# EAGLE design Volumetric Control Board (EAGLE 9.6.1)
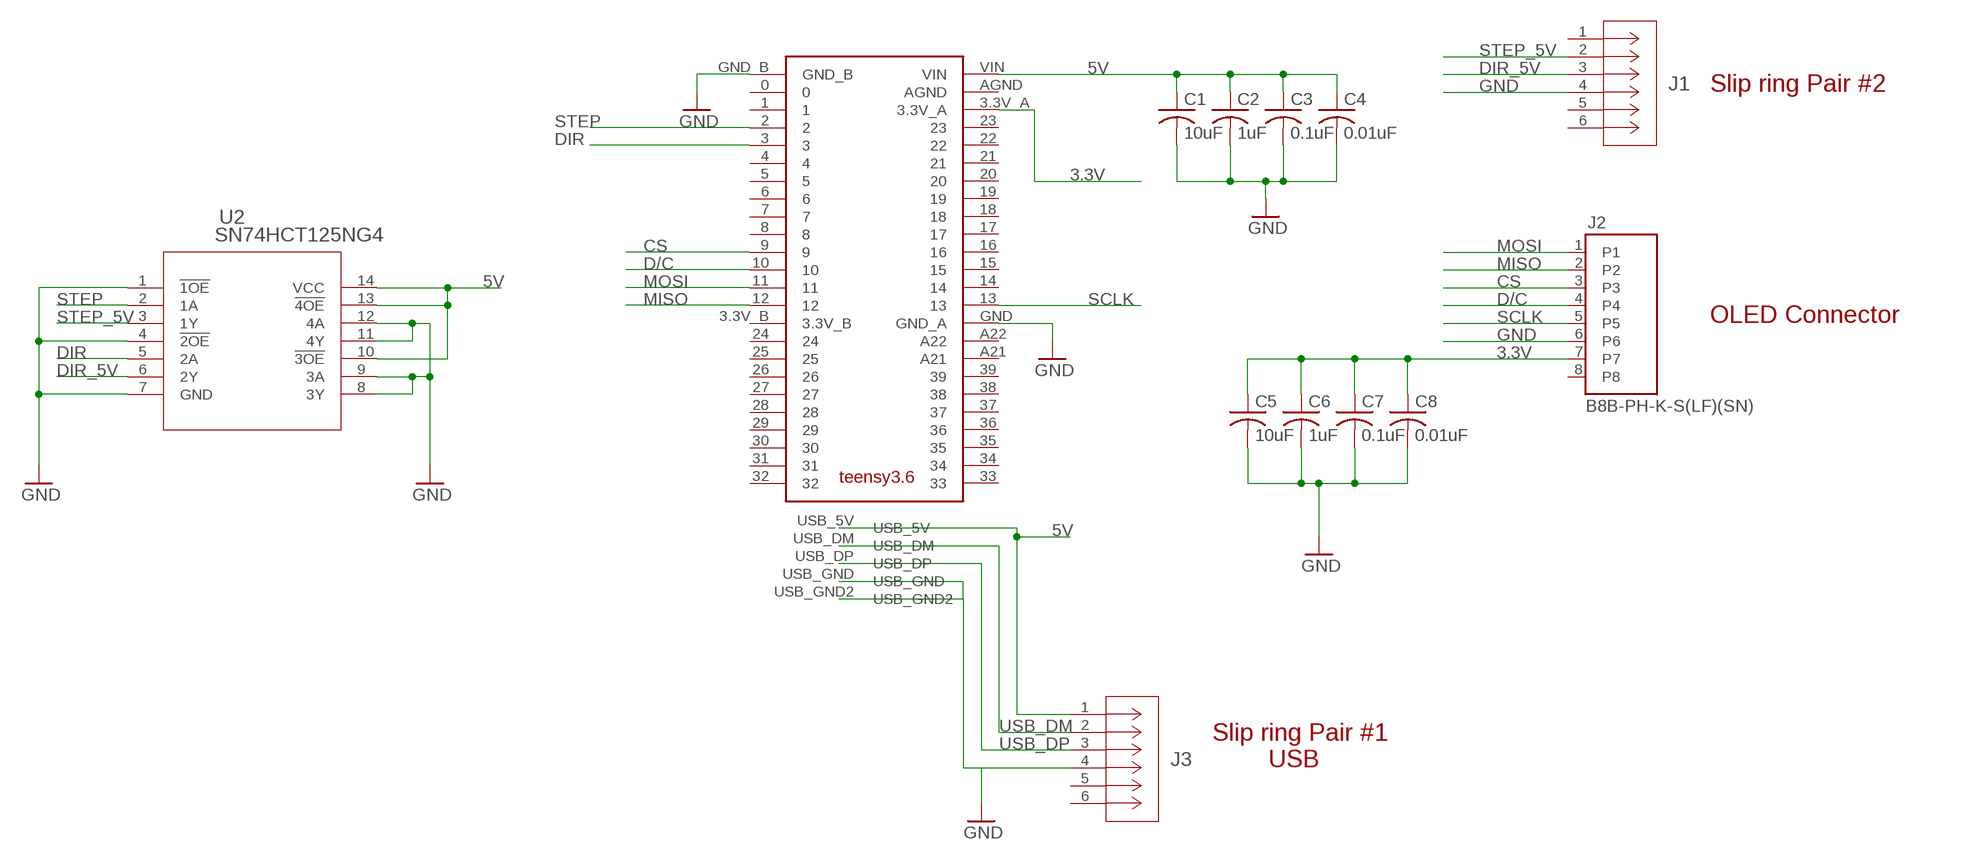
[diagram p0: schematic, sheet 1]

## Parts
C1  10uF  C-USC1206  [C1206]
C2  1uF  C-USC1206  [C1206]
C3  0.1uF  C-USC1206  [C1206]
C4  0.01uF  C-USC1206  [C1206]
C5  10uF  C-USC1206  [C1206]
C6  1uF  C-USC1206  [C1206]
C7  0.1uF  C-USC1206  [C1206]
C8  0.01uF  C-USC1206  [C1206]
J1  B6B-PH-K-S(LF)(SN)  [CONN_B6B-PH-K-S_JST]
J2  B8B-PH-K-S(LF)(SN)  [JST_B8B-PH-K-S(LF)(SN)]
J3  B6B-PH-K-S(LF)(SN)  [CONN_B6B-PH-K-S_JST]
U2  SN74HCT125NG4  [N14_TEX]
U$1  TEENSY3.6  [TEENSY3.6]

## Nets
3.3V: C5.1 C6.1 C7.1 C8.1 J2.7 U$1.3.3V_A
5V: C1.1 C2.1 C3.1 C4.1 J3.1 U2.10(!3OE) U2.13(!4OE) U2.14(VCC) U$1.USB_5V U$1.VIN
CS: J2.3 U$1.9
D/C: J2.4 U$1.10
DIR: U2.5(2A) U$1.3
DIR_5V: J1.3 U2.6(2Y)
GND: C1.2 C2.2 C3.2 C4.2 C5.2 C6.2 C7.2 C8.2 J1.4 J2.6 J3.4 U2.1(!1OE) U2.4(!2OE) U2.7(GND) U2.8(3Y) U2.9(3A) U2.11(4Y) U2.12(4A) U$1.GND(GND_A) U$1.GND_B U$1.USB_GND U$1.USB_GND2
MISO: J2.2 U$1.12
MOSI: J2.1 U$1.11
SCLK: J2.5 U$1.13
STEP: U2.2(1A) U$1.2
STEP_5V: J1.2 U2.3(1Y)
USB_DM: J3.2 U$1.USB_DM
USB_DP: J3.3 U$1.USB_DP
Unconnected: J1.1 J1.5 J1.6 J2.8 J3.5 J3.6 U$1.0 U$1.1 U$1.3.3V_B U$1.4 U$1.5 U$1.6 U$1.7 U$1.8 U$1.14 U$1.15 U$1.16 U$1.17 U$1.18 U$1.19 U$1.20 U$1.21 U$1.22 U$1.23 U$1.24 U$1.25 U$1.26 U$1.27 U$1.28 U$1.29 U$1.30 U$1.31 U$1.32 U$1.33 U$1.34 U$1.35 U$1.36 U$1.37 U$1.38 U$1.39 U$1.A21 U$1.A22 U$1.AGND

## Notes on the sheet
- Slip ring Pair #2
- OLED Connector
- Slip ring Pair #1
          USB

## Library data of the parts
C1-C8 = rcl:C-US: CAPACITOR, American symbol; SPICEPREFIX: C
J1 J3 = volumetric_display:B6B-PH-K-S(LF)(SN); COPYRIGHT: Copyright (C) 2021 Ultra Librarian. All rights reserved.; DIGI-KEY_PART_NUMBER_1: 455-1708-ND; MANUFACTURER_PART_NUMBER: B6B-PH-K-S(LF)(SN); MFR_NAME: JST
J2 = volumetric_display:B8B-PH-K-S(LF)(SN): PH Series 2 mm Pitch 8 Position Through Hole Top Entry Shrouded Header; DESCRIPTION: Connector Header Through Hole 8 position 0.079 (2.00mm); DIGI-KEY_PART_NUMBER: 455-1710-ND; MF: JST Sales; MP: B8B-PH-K-S(LF)(SN); PACKAGE: None
U2 = volumetric_display:SN74HCT125NG4; COPYRIGHT: Copyright (C) 2021 Ultra Librarian. All rights reserved.; DIGI-KEY_PART_NUMBER_1: SN74HCT125NG4-ND; MANUFACTURER_PART_NUMBER: SN74HCT125NG4; MFR_NAME: Texas Instruments
U$1 = volumetric_display:TEENSY3.6

## Board
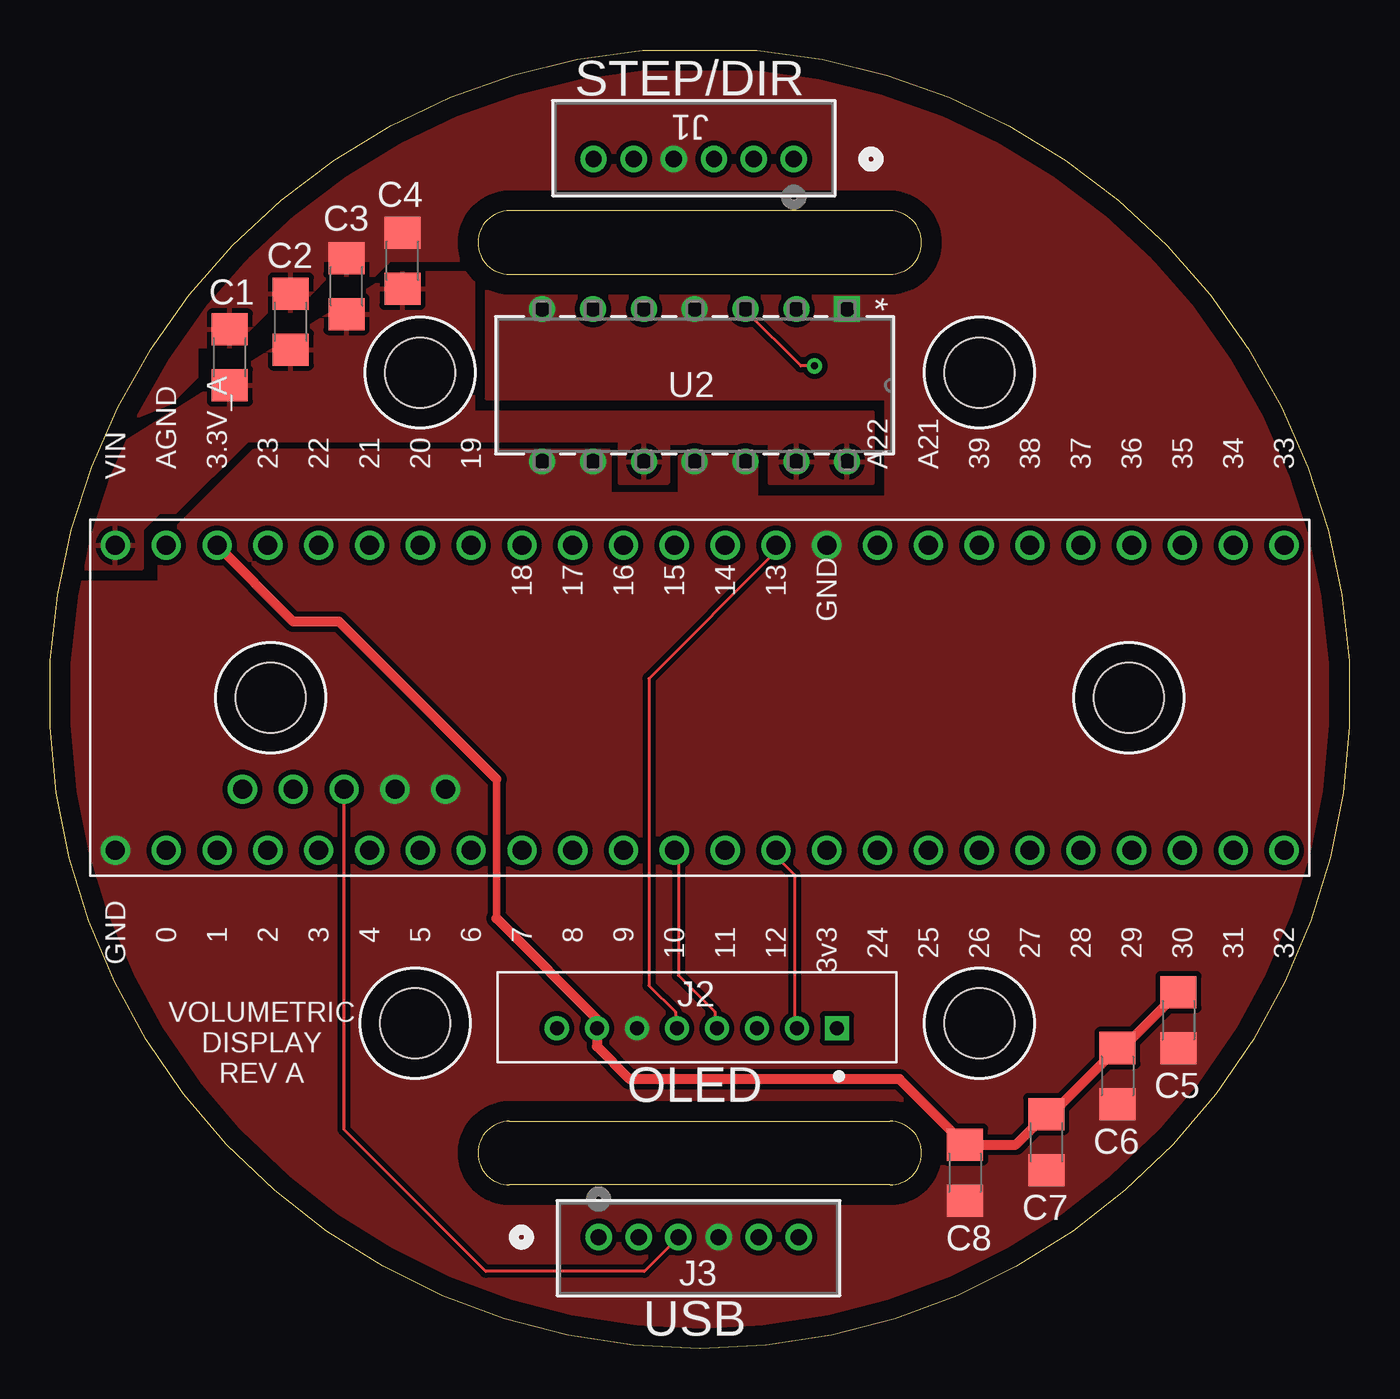
[diagram p1: board, top side]
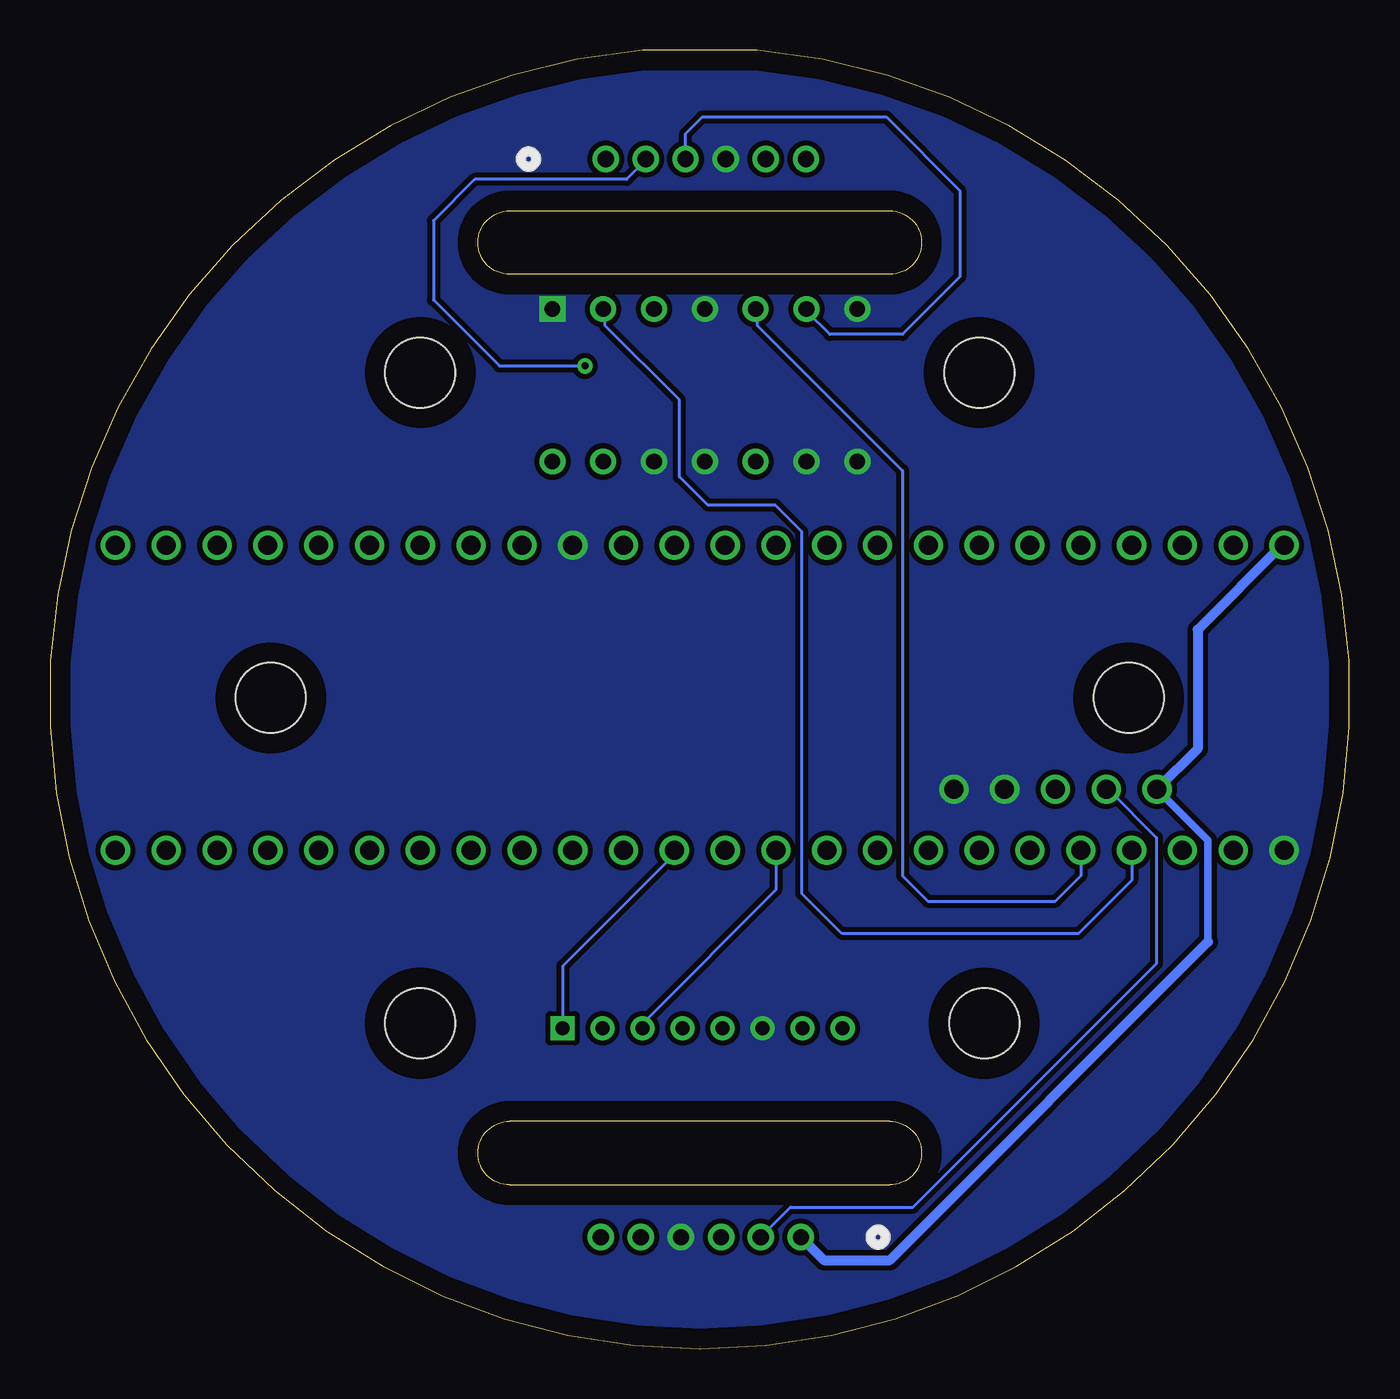
[diagram p2: board, bottom side, seen from below]

Size 64.96 x 64.9 mm. Coordinates in mm from the lower left corner, seen from the top.
Outline: 29.61,64.9 35.35,64.9 arc-350 29.61,64.9
Outline: 22.98,56.86 arc180 22.98,53.69 41.98,53.69 arc180 41.98,56.86 22.98,56.86
Outline: 41.98,8.19 22.98,8.19 arc-180 22.98,11.36 41.98,11.36 arc-180 41.98,8.19
Copper layers (1*16): Top 0.035mm / dielectric 1.5mm / Bottom 0.035mm
Design rules "default": minimum track width 6mil, minimum drill 0.35mm, track to track 6mil, track to pad 6mil, pad to pad 6mil, via to via 6mil, smd to smd 6mil, copper to edge 40mil, drill to drill 6mil, minimum pad ring 10mil, minimum via ring 8mil, stop-mask expansion 4mil, vias tented up to drill 0mil, thermal gap 10mil
Holes 3.5 mm at 53.92,32.52 11.04,32.52 18.51,48.78 46.45,16.27 46.45,48.78 18.26,16.27

### Footprints (pad centres in the part's own frame; a part is rotated, then mirrored left to right if it is on the bottom)
C1206 = smd 1.6 x 1.8: 1 -1.4,0; 2 1.4,0
CONN_B6B-PH-K-S_JST = drill 0.813 pad 1.321: 1 0,0; 2 2.007,0; 3 3.988,0; 4 5.994,0; 5 8.001,0; 6 10.008,0
JST_B8B-PH-K-S(LF)(SN) = drill 0.7 square: 1 0,0 | drill 0.7: 2 2,0; 3 4,0; 4 6,0; 5 8,0; 6 10,0; 7 12,0; 8 14,0
N14_TEX = drill 0.787 pad 1.295 square: 1 0,0 | drill 0.787 pad 1.295: 2 0,-2.54; 3 0,-5.08; 4 0,-7.62; 5 0,-10.16; 6 0,-12.7; 7 0,-15.24; 8 7.62,-15.24; 9 7.62,-12.7; 10 7.62,-10.16; 11 7.62,-7.62; 12 7.62,-5.08; 13 7.62,-2.54; 14 7.62,0
TEENSY3.6 = drill 0.95: 0 -15.24,-2.54; 1 -15.24,-5.08; 2 -15.24,-7.62; 3 -15.24,-10.16; 3.3V_A 0,-5.08; 3.3V_B -15.24,-35.56; 4 -15.24,-12.7; 5 -15.24,-15.24; 6 -15.24,-17.78; 7 -15.24,-20.32; 8 -15.24,-22.86; 9 -15.24,-25.4; 10 -15.24,-27.94; 11 -15.24,-30.48; 12 -15.24,-33.02; 13 0,-33.02; 14 0,-30.48; 15 0,-27.94; 16 0,-25.4; 17 0,-22.86; 18 0,-20.32; 19 0,-17.78; 20 0,-15.24; 21 0,-12.7; 22 0,-10.16; 23 0,-7.62; 24 -15.24,-38.1; 25 -15.24,-40.64; 26 -15.24,-43.18; 27 -15.24,-45.72; 28 -15.24,-48.26; 29 -15.24,-50.8; 30 -15.24,-53.34; 31 -15.24,-55.88; 32 -15.24,-58.42; 33 0,-58.42; 34 0,-55.88; 35 0,-53.34; 36 0,-50.8; 37 0,-48.26; 38 0,-45.72; 39 0,-43.18; A21 0,-40.64; A22 0,-38.1; AGND 0,-2.54; GND 0,-35.56; GND_B -15.24,0; USB_5V -12.19,-6.35; USB_DM -12.19,-8.89; USB_DP -12.19,-11.43; USB_GND -12.19,-13.97; USB_GND2 -12.19,-16.51; VIN 0,0

### Placement (x,y rotation side)
C1  8.99,49.54 90 top
C2  12.03,51.32 90 top
C3  14.83,53.1 90 top
C4  17.62,54.37 90 top
C5  56.41,16.42 270 top
C6  53.36,13.63 270 top
C7  49.8,10.32 270 top
C8  45.74,8.8 270 top
J1  37.18,59.45 180 top
J2  39.34,16.01 180 top
J3  27.43,5.57 0 top
U2  39.85,51.95 270 top
U$1  3.27,40.14 90 top

### Tracks (layer width: path | path; a pad name or v marks a point on that pad's centre or on a via)
3.3V
  Top 0.152: J2.7 27.57,16.25
  Top 0.381: 22.32,28.46 22.32,21.5
  Top 0.508: 22.32,21.5 27.57,16.25 | 22.32,28.46 14.45,36.33 12.16,36.33 U$1.3.3V_A | J2.7 27.34,15.11 28.98,13.47 42.47,13.47 C8.1 48.28,10.2 C7.1 50.06,11.72 C6.1 53.61,15.03 C5.1
5V
  Top 0.152: U2.10 29.69,44.54
  Bottom 0.152: 3.37,40.14 U$1.VIN
  Bottom 0.381: U$1.USB_5V 7.08,25.41 7.08,20.33
  Bottom 0.508: J3.1 26.28,4.43 22.98,4.43 7.08,20.33 | U$1.USB_5V 7.59,29.99 7.59,35.93 3.37,40.14
  pour Top (isolate 0.254): 41.09,46.77 41.09,43.27 36.01,43.27 36.01,45.25 35.99,45.27 30.88,45.27 30.88,43.32 30.83,43.27 28.52,43.27 28.52,45.4 9.82,45.4 6.24,41.82 5.43,41.82 4.57,40.96 4.57,39 -6.27,39 17.24,53.73 21.13,53.73 21.13,46.77
CS
  Bottom 0.152: U$1.9 28.67,22.92 35.22,16.37 35.22,16.06 J2.3
D/C
  Top 0.152: J2.4 33.24,16.06 33.24,16.83 31.41,18.66 31.41,24.75 31.26,24.9 U$1.10
DIR
  Bottom 0.152: U$1.3 13.43,23.63 14.7,22.36 21.08,22.36 22.35,23.63 22.35,43.88 29.58,51.12 29.58,51.88 U2.5
DIR_5V
  Bottom 0.152: U2.6 27.15,51.85 25.98,50.68 22.35,50.68 19.48,53.55 19.48,57.87 23.16,61.56 32.35,61.56 33.19,60.72 J1.3
GND
  pour Bottom (isolate 0.254, no thermals): -10.7,70.62 -10.7,-4.31 76.93,-4.31 76.93,70.62
  pour Top (isolate 0.254, no thermals): -1.81,54.44 21.08,54.44 21.84,53.68 21.84,47.51 41.8,47.51 41.8,42.51 35.3,42.51 35.3,44.56 31.49,44.56 31.49,42.68 27.96,42.68 27.96,44.84 10.2,44.84 5.48,40.12 5.48,38.24 -1.81,38.24 -1.81,-5.58 73.12,-5.58 73.12,70.62 -1.81,70.62
  pour Top: -3.08,55.38 17.24,55.38 17.24,54.62 16.22,53.61 13.94,53.61 12.92,52.59 12.92,51.83 10.89,51.83 9.87,50.81 9.87,50.05 7.33,50.05 7.33,48.53 6.06,47.26 4.33,46.54 3.78,45.99 3.52,45.99 2.76,45.22 -3.08,45.22
MISO
  Top 0.152: U$1.12 36.29,24.6 37.2,23.68 37.2,16.06 J2.2
MOSI
  Bottom 0.152: J2.1 39.34,19.11 33.85,24.6 33.85,24.9 U$1.11
SCLK
  Top 0.152: U$1.13 36.29,39.84 29.94,33.49 29.94,18.15 31.26,16.83 31.26,16.06 J2.5
STEP
  Bottom 0.152: U$1.2 10.89,23.4 13.56,20.74 25.37,20.74 27.38,22.74 27.38,40.83 28.7,42.15 32.07,42.15 33.5,43.57 33.5,47.41 37.2,51.12 37.2,51.88 U2.2
STEP_5V  (via drill 0.35)
  Top 0.152: v38.22,49.11 37.54,49.11 34.77,51.88 U2.3
  Bottom 0.152: v38.22,49.11 42.49,49.11 45.79,52.41 45.79,56.37 43.73,58.43 36.14,58.43 35.22,59.35 J1.2
USB_DM
  Bottom 0.152: J3.2 27.93,7.07 21.81,7.07 9.65,19.24 9.65,25.54 12.06,27.95 U$1.USB_DM
USB_DP
  Top 0.152: U$1.USB_DP 14.7,10.95 21.78,3.87 29.71,3.87 J3.3

### Text on the board
tPlace: STEP/DIR | VOLUMETRIC / DISPLAY / REV A | OLED | USB